# EAGLE design quadrature (EAGLE 9.2.2)
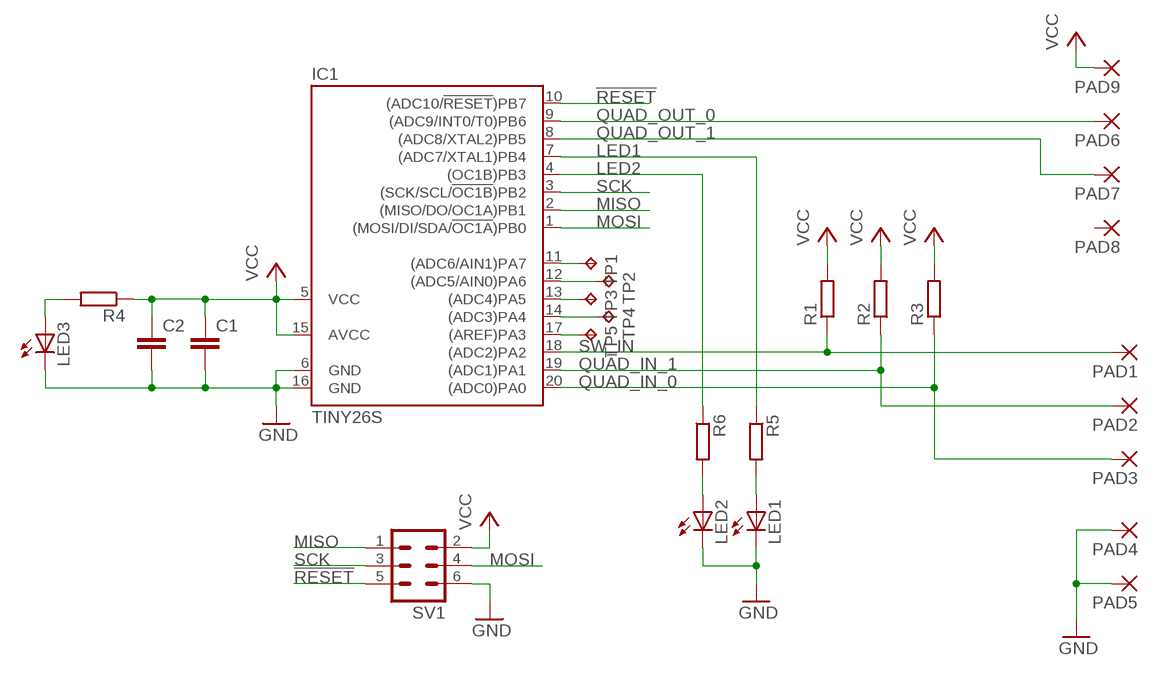
[diagram p0: schematic, sheet 1]

## Parts
C1  C-EUC0603  [C0603]
C2  C-EUC0603  [C0603]
IC1  TINY26S  [SO20L]
LED1  LEDCHIP-LED0603  [CHIP-LED0603]
LED2  LEDCHIP-LED0603  [CHIP-LED0603]
LED3  LEDCHIP-LED0603  [CHIP-LED0603]
PAD1  1,6/0,8  [1,6/0,8]
PAD2  1,6/0,8  [1,6/0,8]
PAD3  1,6/0,8  [1,6/0,8]
PAD4  1,6/0,8  [1,6/0,8]
PAD5  1,6/0,8  [1,6/0,8]
PAD6  1,6/0,8  [1,6/0,8]
PAD7  1,6/0,8  [1,6/0,8]
PAD8  1,6/0,8  [1,6/0,8]
PAD9  1,6/0,8  [1,6/0,8]
R1  R-EU_R0603  [R0603]
R2  R-EU_R0603  [R0603]
R3  R-EU_R0603  [R0603]
R4  R-EU_R0603  [R0603]
R5  R-EU_R0603  [R0603]
R6  R-EU_R0603  [R0603]
SV1  ML6  [ML6]
TP1  TPB1,27  [B1,27]
TP2  TPB1,27  [B1,27]
TP3  TPB1,27  [B1,27]
TP4  TPB1,27  [B1,27]
TP5  TPB1,27  [B1,27]

## Nets
!RESET: IC1.10((ADC10/!RESET!)PB7) SV1.5
GND: C1.2 C2.2 IC1.6(GND) IC1.16(GND) LED1.C LED2.C LED3.C PAD4.1(P) PAD5.1(P) SV1.6
LED1: IC1.7((ADC7/XTAL1)PB4) R5.1
LED2: IC1.4((OC1B)PB3) R6.1
MISO: IC1.2((MISO/DO/OC1A)PB1) SV1.1
MOSI: IC1.1((MOSI/DI/SDA/!OC1A!)PB0) SV1.4
N$1: IC1.11((ADC6/AIN1)PA7) TP1.TP
N$2: LED3.A R4.2
N$3: IC1.12((ADC5/AIN0)PA6) TP2.TP
N$4: IC1.13((ADC4)PA5) TP3.TP
N$5: LED1.A R5.2
N$6: LED2.A R6.2
N$7: IC1.14((ADC3)PA4) TP4.TP
N$8: IC1.17((AREF)PA3) TP5.TP
QUAD_IN_0: IC1.20((ADC0)PA0) PAD3.1(P) R3.1
QUAD_IN_1: IC1.19((ADC1)PA1) PAD2.1(P) R2.1
QUAD_OUT_0: IC1.9((ADC9/INT0/T0)PB6) PAD6.1(P)
QUAD_OUT_1: IC1.8((ADC8/XTAL2)PB5) PAD7.1(P)
SCK: IC1.3((SCK/SCL/!OC1B!)PB2) SV1.3
SW_IN: IC1.18((ADC2)PA2) PAD1.1(P) R1.1
VCC: C1.1 C2.1 IC1.5(VCC) IC1.15(AVCC) PAD9.1(P) R1.2 R2.2 R3.2 R4.1 SV1.2
Unconnected: PAD8.1(P)

## Library data of the parts
C1 C2 = rcl:C-EU: CAPACITOR, European symbol; SPICEPREFIX: C
IC1 = atmel:TINY26*: 8-bit AVR Microcontroller with 2K Bytes Flash Source: http://www.atmel.com .. doc1477.pdf; MPN: ATTINY261-20SU; OC_FARNELL: 1455147; OC_NEWARK: 58M3783
LED1-LED3 = led:LED: LED OSRAM: - CHIPLED LG R971, LG N971, LY N971, LG Q971, LY Q971, LO R971, LY R971 LH N974, LH R974 LS Q976, LO Q976, LY Q976 LO Q996 - Hyper CHIPLED LW Q18S LB Q993, LB Q99A, LB R99A - SideLED LS A670, LO A670, LY A670, LG A670, LP A670 LB A673, LV A673, LT A673, LW A673 LH A674 LY A675 LS A676, LA A676, LO A676, LY A676, LW A676 LS A679, LY A679, LG A679 - Hyper Micro SIDELED® LS Y876, LA Y876, LO Y876, LY Y876 LT Y87S - SmartLED LW L88C, LW L88S LB L89C, LB L89S, LG L890 LS L89K, LO L89K, LY L89K LS L896, LA L896, LO L896, LY L896 - TOPLED LS T670, LO T670, LY T670, LG T670, LP T670 LSG T670, LSP T670, LSY T670, LOP T670, LYG T670 LG T671, LOG T671, LSG T671 LB T673, LV T673, LT T673, LW T673 LH T674 LS T676, LA T676, LO T676, LY T676, LB T676, LH T676, LSB T676, LW T676 LB T67C, LV T67C, LT T67C, LS T67K, LO T67K, LY T67K, LW E67C LS E67B, LA E67B, LO E67B, LY E67B, LB E67C, LV E67C, LT E67C LW T67C LS T679, LY T679, LG T679 LS T770, LO T770, LY T770, LG T770, LP T770 LB T773, LV T773, LT T773, LW T773 LH T774 LS E675, LA E675, LY E675, LS T675 LS T776, LA T776, LO T776, LY T776, LB T776 LHGB T686 LT T68C, LB T68C - Hyper Mini TOPLED® LB M676 - Mini TOPLED Santana® LG M470 LS M47K, LO M47K, LY M47K Source: http://www.osram.convergy.de LUXEON: - LUMILED® LXK2-PW12-R00, LXK2-PW12-S00, LXK2-PW14-U00, LXK2-PW14-V00 LXK2-PM12-R00, LXK2-PM12-S00, LXK2-PM14-U00 LXK2-PE12-Q00, LXK2-PE12-R00, LXK2-PE12-S00, LXK2-PE14-T00, LXK2-PE14-U00 LXK2-PB12-K00, LXK2-PB12-L00, LXK2-PB12-M00, LXK2-PB14-N00, LXK2-PB14-P00, LXK2-PB14-Q00 LXK2-PR12-L00, LXK2-PR12-M00, LXK2-PR14-Q00, LXK2-PR14-R00 LXK2-PD12-Q00, LXK2-PD12-R00, LXK2-PD12-S00 LXK2-PH12-R00, LXK2-PH12-S00 LXK2-PL12-P00, LXK2-PL12-Q00, LXK2-PL12-R00 Source: www.luxeon.com KINGBRIGHT: KA-3528ASYC Source: www.kingbright.com
PAD1-PAD9 = wirepad:1,6/0,8: THROUGH-HOLE PAD
R1-R6 = rcl:R-EU_: RESISTOR, European symbol; SPICEPREFIX: R
SV1 = con-harting-ml:ML6: HARTING; OC_FARNELL: unknown; OC_NEWARK: unknown
TP1-TP5 = testpad:TP: Test pad

## Board
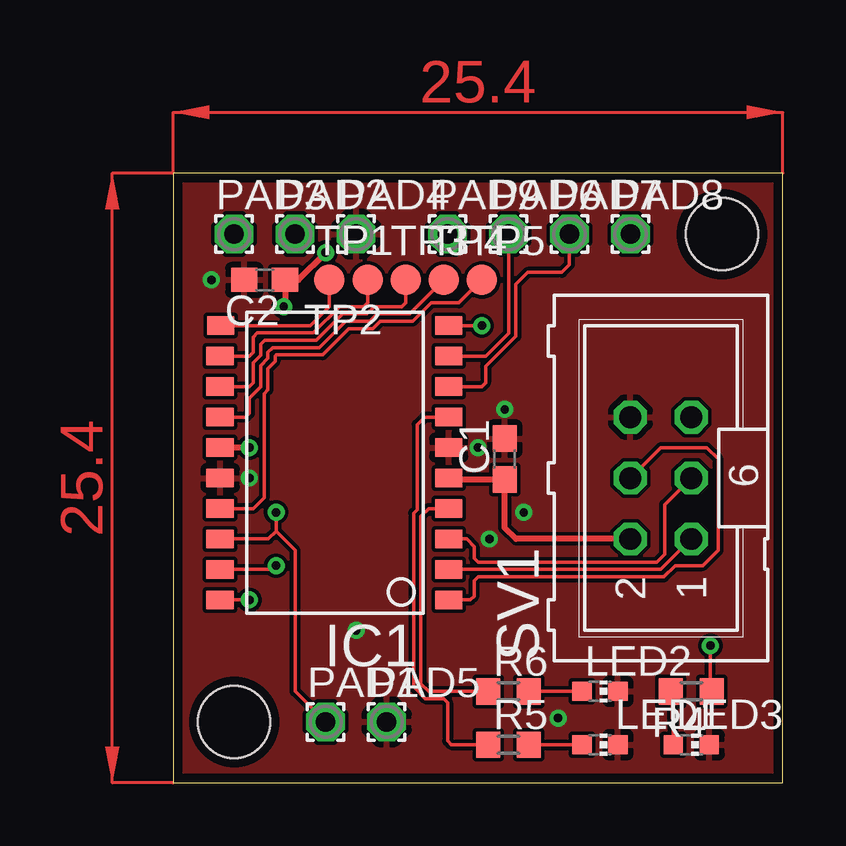
[diagram p1: board, top side]
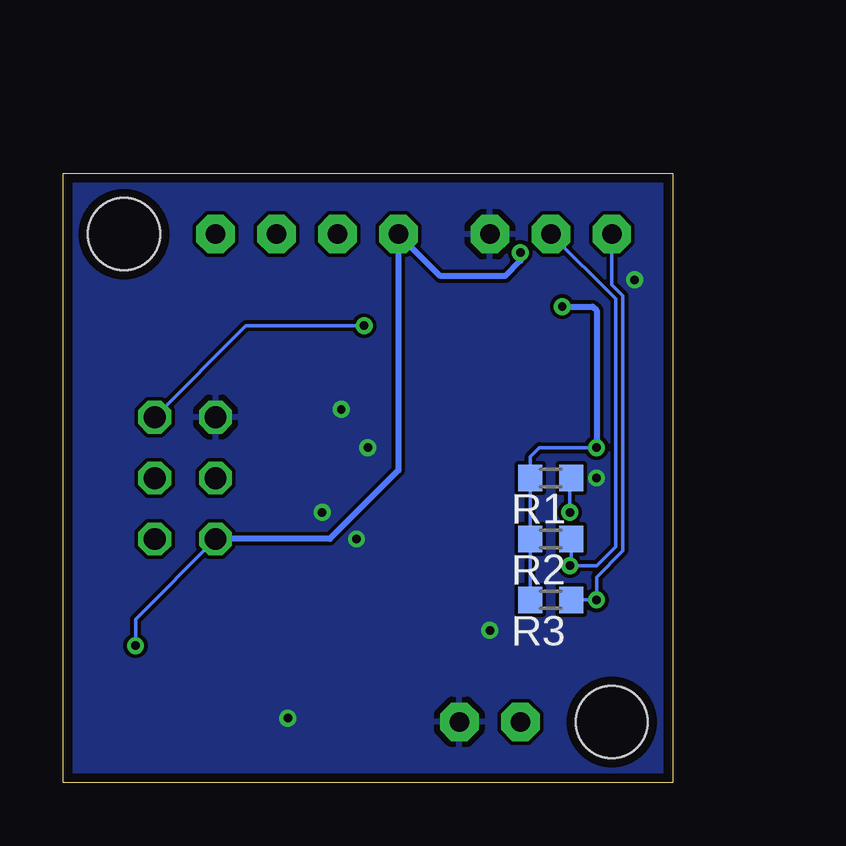
[diagram p2: board, bottom side, seen from below]

Size 25.4 x 25.4 mm. Coordinates in mm from the lower left corner, seen from the top.
Outline: 0,0 25.4,0 25.4,25.4 0,25.4 0,0
Copper layers (1*16): Top 0.0356mm / dielectric 1.5011mm / Bottom 0.0356mm
Design rules "oshpark-2layer": minimum track width 6mil, minimum drill 13mil, track to track 6mil, track to pad 6mil, pad to pad 6mil, via to via 6mil, smd to smd 6mil, copper to edge 15mil, drill to drill 6mil, minimum pad ring 7mil, minimum via ring 7mil, stop-mask expansion 2.5mil, vias tented up to drill 0mil, thermal gap 10mil
Holes 3 mm at 2.54,2.54 22.86,22.86

### Footprints (pad centres in the part's own frame; a part is rotated, then mirrored left to right if it is on the bottom)
C0603 = smd 1.1 x 1: 1 -0.85,0; 2 0.85,0
SO20L = smd 0.762 x 1.143: 1 -5.08,-5.131; 2 -3.81,-5.131; 3 -2.54,-5.131; 4 -1.27,-5.131; 5 0,-5.131; 6 1.27,-5.131; 7 2.54,-5.131; 8 3.81,-5.131; 9 5.08,-5.131; 10 6.35,-5.131; 11 6.35,4.369; 12 5.08,4.394; 13 3.81,4.394; 14 2.54,4.394; 15 1.27,4.394; 16 0,4.394; 17 -1.27,4.394; 18 -2.54,4.394; 19 -3.81,4.394; 20 -5.08,4.394
CHIP-LED0603 = smd 0.8 x 0.8: A 0,-0.75; C 0,0.75
1,6/0,8 = drill 0.813 pad 1.6 octagon: 1 0,0
R0603 = smd 1 x 1.1: 1 -0.85,0; 2 0.85,0
ML6 = drill 0.914 octagon: 1 -2.54,-1.27; 2 -2.54,1.27; 3 0,-1.27; 4 0,1.27; 5 2.54,-1.27; 6 2.54,1.27
B1,27 = smd 1.27 x 1.27: TP 0,0

### Placement (x,y rotation side)
C1  13.81,13.49 90 top
C2  3.81,20.95 180 top
IC1  6.35,12.7 90 top
LED1  17.78,1.59 270 top
LED2  17.78,3.81 270 top
LED3  21.59,1.59 270 top
PAD1  6.35,2.54 0 top
PAD2  5.08,22.86 0 top
PAD3  2.54,22.86 0 top
PAD4  7.62,22.86 0 top
PAD5  8.89,2.54 0 top
PAD6  13.97,22.86 0 top
PAD7  16.51,22.86 0 top
PAD8  19.05,22.86 0 top
PAD9  11.43,22.86 0 top
R1  5.08,12.7 180 bottom
R2  5.08,10.16 180 bottom
R3  5.08,7.62 180 bottom
R4  21.59,3.81 180 top
R5  13.97,1.59 0 top
R6  13.97,3.81 0 top
SV1  20.32,12.7 90 top
TP1  6.51,20.95 0 top
TP2  8.1,20.95 180 top
TP3  9.68,20.95 0 top
TP4  11.27,20.95 0 top
TP5  12.86,20.95 0 top

### Tracks (layer width: path | path; a pad name or v marks a point on that pad's centre or on a via)
!RESET  (via drill 0.35)
  Top 0.152: IC1.10 v12.86,19.05
  Bottom 0.152: v12.86,19.05 17.78,19.05 SV1.5
GND  (via drill 0.35)
  other vias: 1.59,20.95 13.81,15.56 12.7,13.97 13.18,10.16 14.61,11.27 16.03,2.7 3.17,12.7 7.62,6.35
  pour Bottom: 0,25.4 25.4,25.4 25.4,0 0,0
  pour Top: 0,25.4 25.4,25.4 25.4,0 0,0
LED1
  Top 0.152: IC1.7 10.48,15.24 10.16,14.92 10.16,11.38 10.01,11.24 10.01,4 10.51,3.5 11.27,3.5 11.43,3.35 11.43,1.75 11.59,1.59 R5.1
LED2
  Top 0.152: IC1.4 10.64,11.43 10.32,11.11 10.32,4.13 10.64,3.81 R6.1
MISO
  Top 0.152: IC1.2 20.32,8.89 SV1.1
MOSI
  Top 0.152: IC1.1 12.38,7.62 12.54,7.78 12.54,8.43 12.7,8.59 20.45,8.59 20.91,9.05 22.07,9.05 22.7,9.68 22.7,13.49 22.23,13.97 20.32,13.97 SV1.4
N$1
  Top 0.152: IC1.11 5.71,19.05 6.51,19.84 TP1.TP
N$2
  Top 0.152: LED3.A 20.84,2.65 20.8,2.7 20.8,3.75 R4.2
N$3
  Top 0.152: IC1.12 3.17,17.78 3.33,17.94 3.33,18.57 3.5,18.75 5.84,18.75 6.94,19.84 7.94,19.84 8.1,20 TP2.TP
N$4
  Top 0.152: IC1.13 3.17,16.51 3.33,16.67 3.33,17.51 3.64,17.81 3.64,18.27 3.81,18.44 5.97,18.44 7.07,19.54 8.06,19.54 8.37,19.84 9.53,19.84 9.68,20 TP3.TP
N$5
  Top 0.152: R5.2 LED1.A
N$6
  Top 0.152: R6.2 LED2.A
N$7
  Top 0.152: TP4.TP 9.86,19.54 8.49,19.54 8.19,19.23 7.19,19.23 6.09,18.14 4.14,18.14 3.94,17.94 3.94,17.69 3.64,17.38 3.64,16.5 3.17,16.03 3.17,15.4 3.02,15.24 IC1.14
N$8
  Top 0.152: TP5.TP 11.91,20 10.75,20 9.98,19.23 8.62,19.23 8.32,18.93 7.32,18.93 6.22,17.83 4.3,17.83 4.25,17.78 4.25,17.56 3.94,17.25 3.94,16.37 3.79,16.21 3.79,11.88 3.33,11.43 IC1.17
QUAD_IN_0  (via drill 0.35)
  Top 0.152: IC1.20 v3.17,7.62
  Bottom 0.152: R3.1 v3.17,7.62 3.17,8.57 2.08,9.67 2.08,20.29 2.54,20.75 PAD3.1
QUAD_IN_1  (via drill 0.35)
  Top 0.152: IC1.19 4.13,8.89 arc90 v4.29,9.05
  Bottom 0.152: R2.1 4.23,9.11 arc90 v4.29,9.05 3.17,9.05 2.38,9.84 2.38,20.16 PAD2.1
QUAD_OUT_0
  Top 0.152: IC1.9 13.02,17.78 13.97,18.73 PAD6.1
QUAD_OUT_1
  Top 0.152: PAD7.1 16.51,21.59 16.19,21.27 14.76,21.27 14.28,20.78 14.28,18.61 13.02,17.35 13.02,16.67 12.86,16.51 IC1.8
SCK
  Top 0.152: IC1.3 12.22,10.16 12.54,9.84 12.54,9.37 12.71,9.2 20.15,9.2 20.48,9.53 20.48,11.59 SV1.3
SW_IN  (via drill 0.35)
  Top 0.152: IC1.18 3.97,10.16 4.29,10.48 | 4.29,10.48 v4.29,11.27 | PAD1.1 5.08,3.81 5.08,9.68 4.29,10.48
  Bottom 0.152: v4.29,11.27 4.29,12.64 R1.1
VCC  (via drill 0.35)
  Top 0.152: R4.1 22.38,3.81 v22.38,5.71
  Top 0.254: v4.6,19.84 4.66,19.9 C2.1 5.21,20.95 v6.35,22.09 | v3.17,13.97 IC1.15 | SV1.2 14.29,10.16 13.81,10.64 C1.1 11.54,12.64 IC1.5
  Bottom 0.152: R3.2 R2.2 R1.2 5.93,13.6 5.56,13.97 v3.17,13.97 | v22.38,5.71 22.38,6.83 SV1.2
  Bottom 0.254: v4.6,19.84 3.33,19.84 3.17,19.68 v3.17,13.97 | v6.35,22.09 6.35,21.75 6.99,21.11 9.68,21.11 PAD9.1 11.43,13.02 14.29,10.16 SV1.2
(copper drawn outside any net)
  shapes: Top area x2